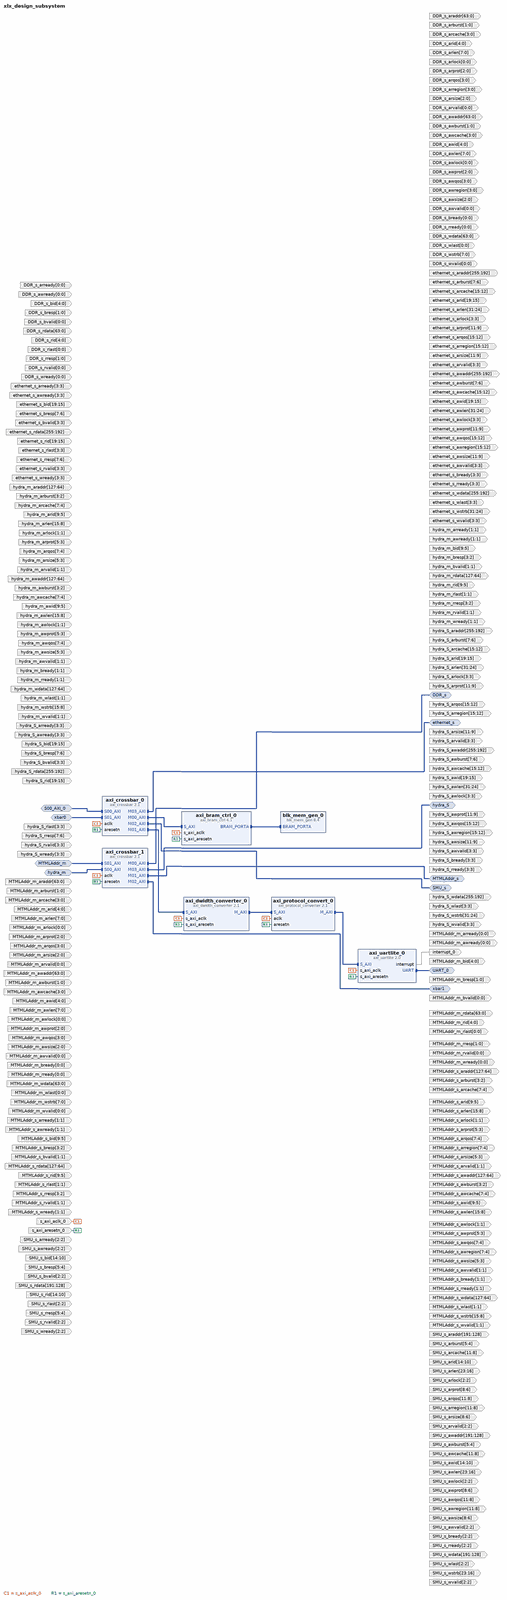
[diagram p0: block diagram of the top level, whole]
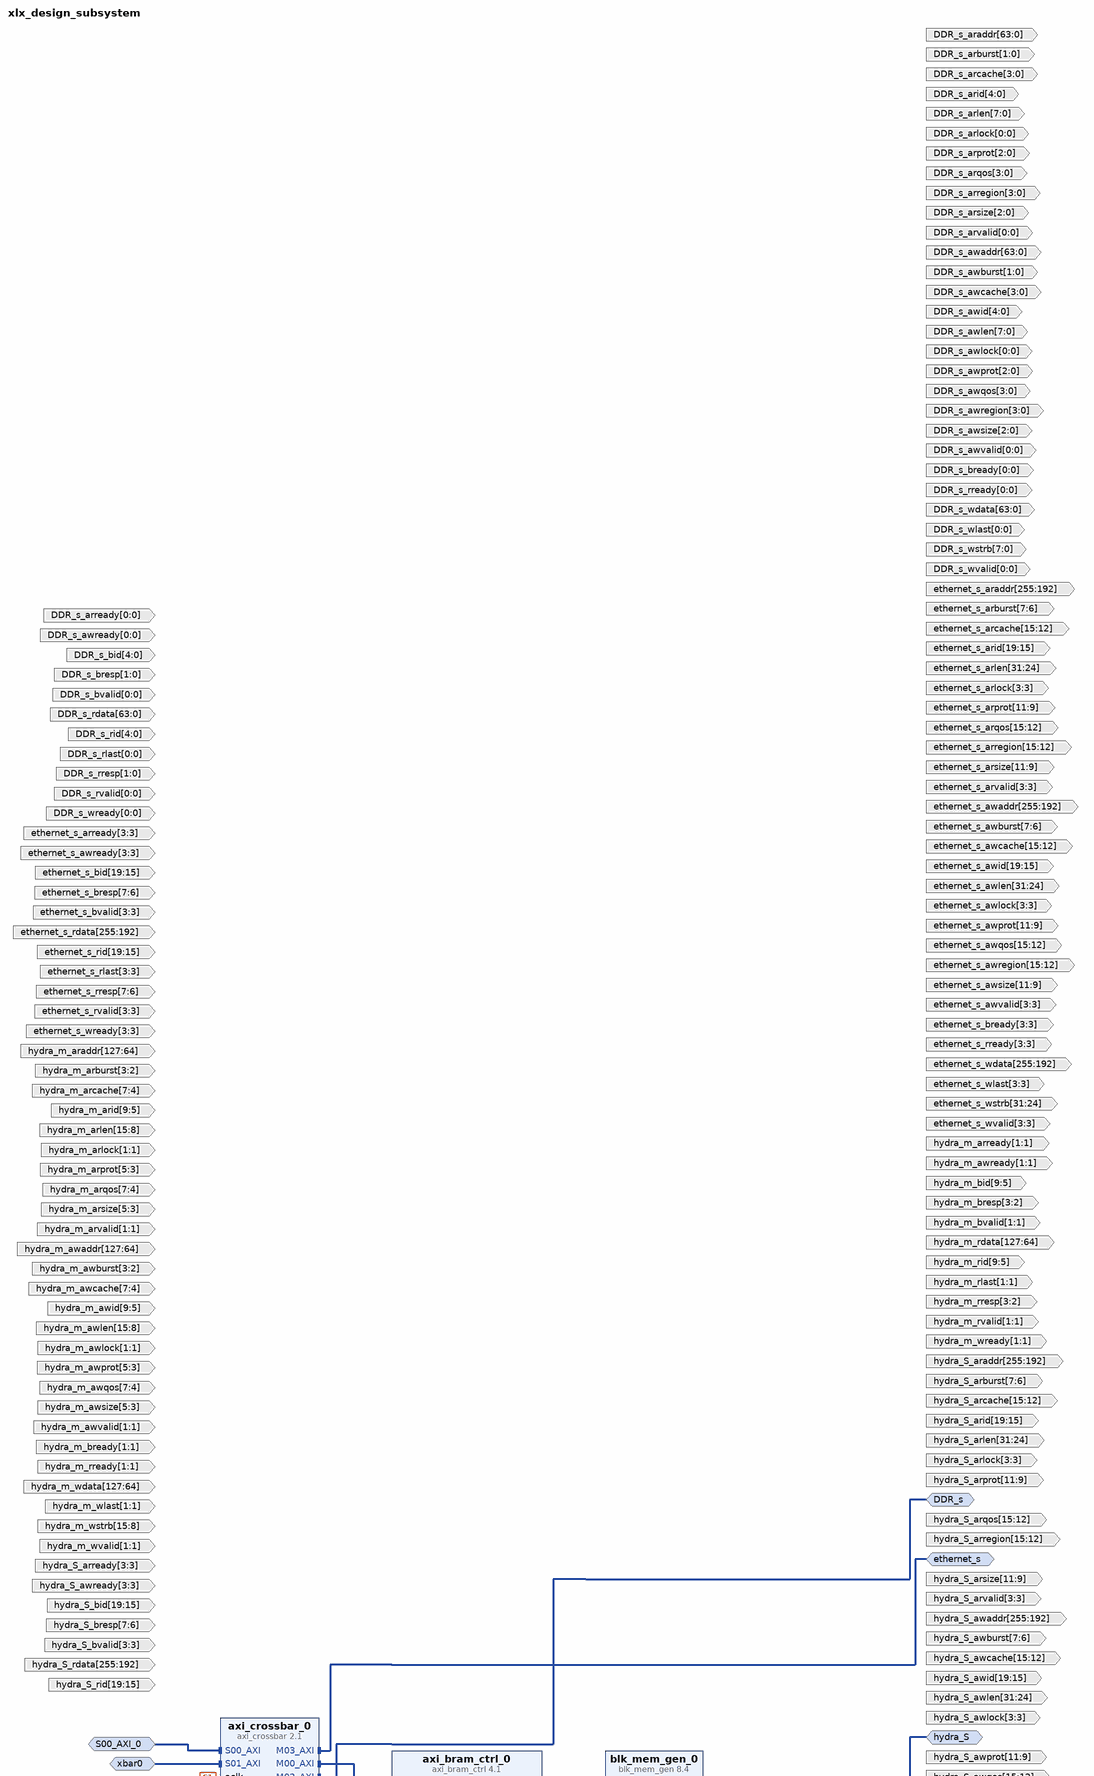
[diagram p1: block diagram of the top level, upper part]
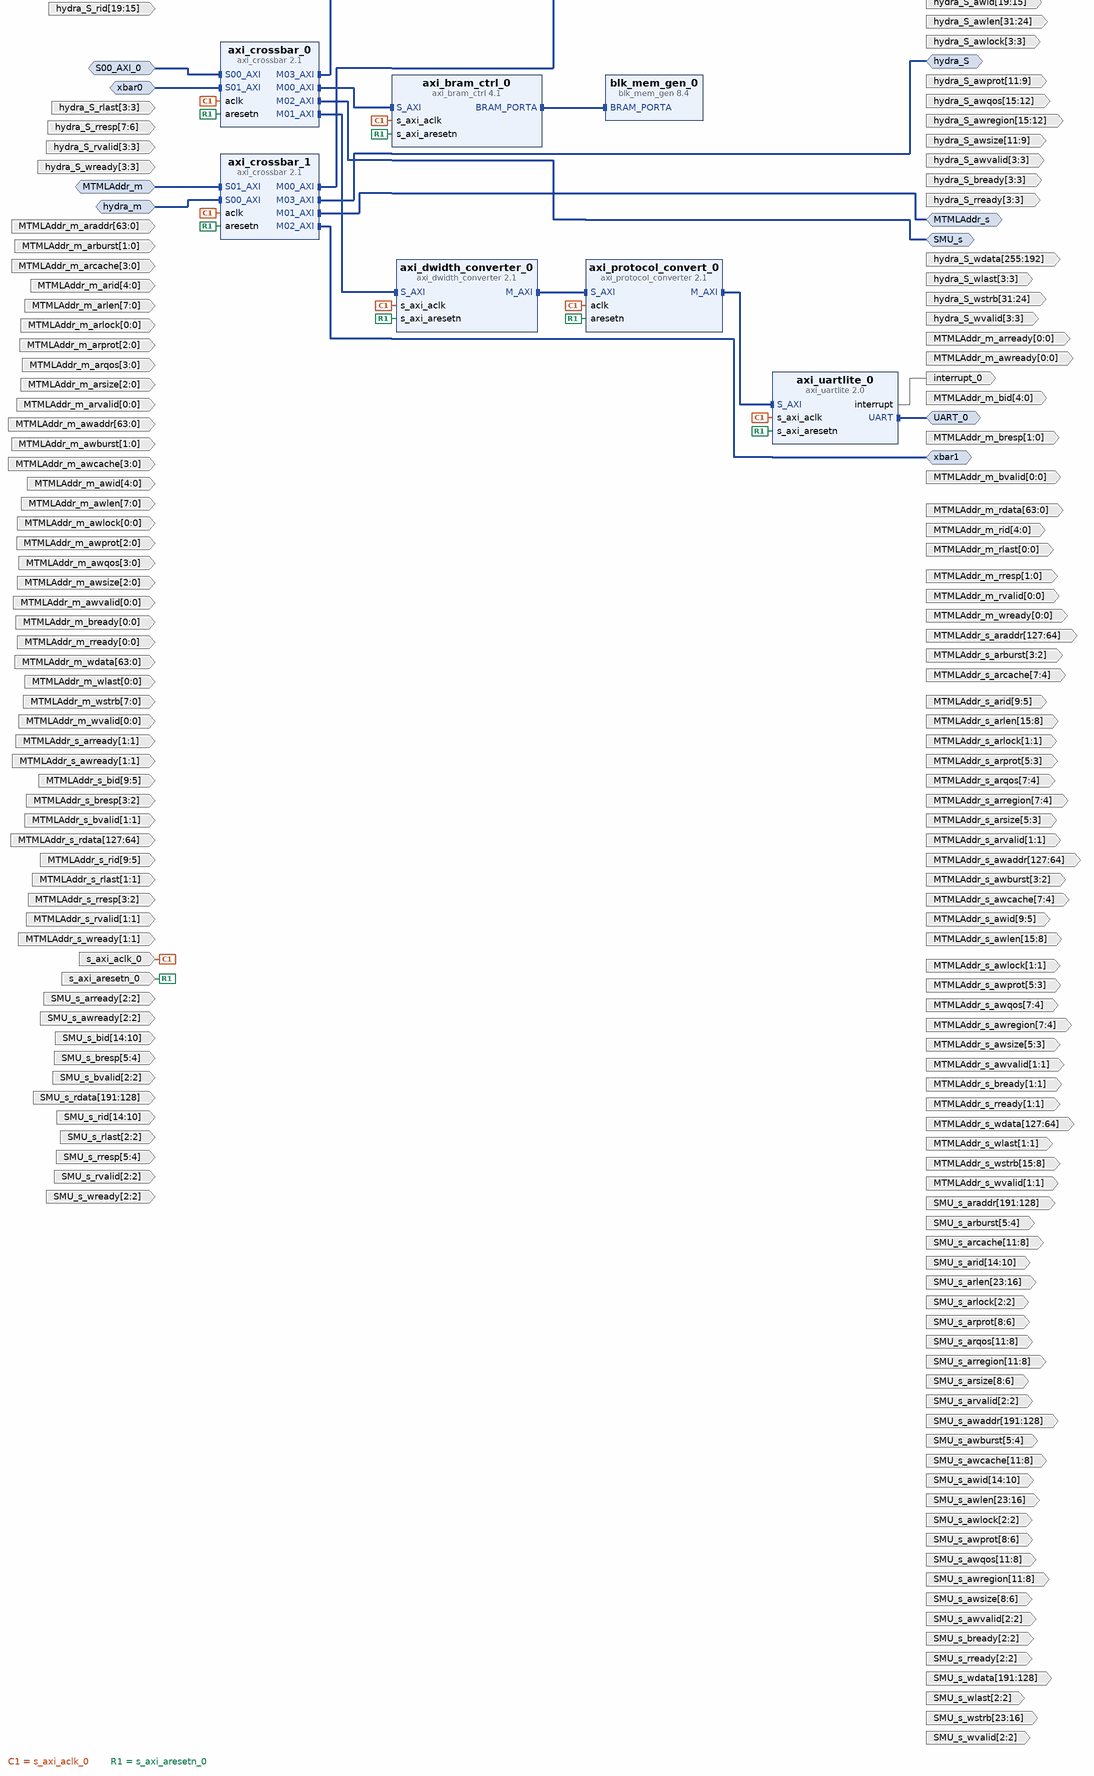
[diagram p2: block diagram of the top level, lower part]
# Vivado block design xlx_design_subsystem, xcvu9p-flga2104-1-e, Vivado 2021.1
create_bd_design xlx_design_subsystem

create_bd_intf_port -mode Slave -vlnv xilinx.com:interface:aximm_rtl:1.0 hydra_m
set_property -dict [list \
  CONFIG.ADDR_WIDTH 64 \
  CONFIG.ARUSER_WIDTH 0 \
  CONFIG.AWUSER_WIDTH 0 \
  CONFIG.BUSER_WIDTH 0 \
  CONFIG.DATA_WIDTH 64 \
  CONFIG.FREQ_HZ 10000000 \
  CONFIG.HAS_BRESP 1 \
  CONFIG.HAS_BURST 1 \
  CONFIG.HAS_CACHE 1 \
  CONFIG.HAS_LOCK 1 \
  CONFIG.HAS_PROT 1 \
  CONFIG.HAS_QOS 1 \
  CONFIG.HAS_REGION 0 \
  CONFIG.HAS_RRESP 1 \
  CONFIG.HAS_WSTRB 1 \
  CONFIG.ID_WIDTH 5 \
  CONFIG.MAX_BURST_LENGTH 256 \
  CONFIG.NUM_READ_OUTSTANDING 2 \
  CONFIG.NUM_READ_THREADS 1 \
  CONFIG.NUM_WRITE_OUTSTANDING 2 \
  CONFIG.NUM_WRITE_THREADS 1 \
  CONFIG.PROTOCOL AXI4 \
  CONFIG.READ_WRITE_MODE READ_WRITE \
  CONFIG.RUSER_BITS_PER_BYTE 0 \
  CONFIG.RUSER_WIDTH 0 \
  CONFIG.SUPPORTS_NARROW_BURST 1 \
  CONFIG.WUSER_BITS_PER_BYTE 0 \
  CONFIG.WUSER_WIDTH 0 \
] [get_bd_intf_ports hydra_m]
create_bd_intf_port -mode Master -vlnv xilinx.com:interface:aximm_rtl:1.0 SMU_s
set_property -dict [list \
  CONFIG.ADDR_WIDTH 64 \
  CONFIG.DATA_WIDTH 64 \
  CONFIG.FREQ_HZ 10000000 \
  CONFIG.NUM_READ_OUTSTANDING 2 \
  CONFIG.NUM_WRITE_OUTSTANDING 2 \
  CONFIG.PROTOCOL AXI4 \
] [get_bd_intf_ports SMU_s]
create_bd_intf_port -mode Master -vlnv xilinx.com:interface:aximm_rtl:1.0 ethernet_s
set_property -dict [list \
  CONFIG.ADDR_WIDTH 64 \
  CONFIG.DATA_WIDTH 64 \
  CONFIG.FREQ_HZ 10000000 \
  CONFIG.NUM_READ_OUTSTANDING 2 \
  CONFIG.NUM_WRITE_OUTSTANDING 2 \
  CONFIG.PROTOCOL AXI4 \
] [get_bd_intf_ports ethernet_s]
create_bd_intf_port -mode Master -vlnv xilinx.com:interface:aximm_rtl:1.0 hydra_S
set_property -dict [list \
  CONFIG.ADDR_WIDTH 64 \
  CONFIG.DATA_WIDTH 64 \
  CONFIG.FREQ_HZ 10000000 \
  CONFIG.NUM_READ_OUTSTANDING 2 \
  CONFIG.NUM_WRITE_OUTSTANDING 2 \
  CONFIG.PROTOCOL AXI4 \
] [get_bd_intf_ports hydra_S]
create_bd_intf_port -mode Master -vlnv xilinx.com:interface:aximm_rtl:1.0 DDR_s
set_property -dict [list \
  CONFIG.ADDR_WIDTH 64 \
  CONFIG.DATA_WIDTH 64 \
  CONFIG.FREQ_HZ 10000000 \
  CONFIG.HAS_REGION 0 \
  CONFIG.NUM_READ_OUTSTANDING 2 \
  CONFIG.NUM_WRITE_OUTSTANDING 2 \
  CONFIG.PROTOCOL AXI4 \
] [get_bd_intf_ports DDR_s]
create_bd_intf_port -mode Master -vlnv xilinx.com:interface:aximm_rtl:1.0 MTMLAddr_s
set_property -dict [list \
  CONFIG.ADDR_WIDTH 64 \
  CONFIG.DATA_WIDTH 64 \
  CONFIG.FREQ_HZ 10000000 \
  CONFIG.NUM_READ_OUTSTANDING 2 \
  CONFIG.NUM_WRITE_OUTSTANDING 2 \
  CONFIG.PROTOCOL AXI4 \
] [get_bd_intf_ports MTMLAddr_s]
create_bd_intf_port -mode Slave -vlnv xilinx.com:interface:aximm_rtl:1.0 MTMLAddr_m
set_property -dict [list \
  CONFIG.ADDR_WIDTH 64 \
  CONFIG.ARUSER_WIDTH 0 \
  CONFIG.AWUSER_WIDTH 0 \
  CONFIG.BUSER_WIDTH 0 \
  CONFIG.DATA_WIDTH 64 \
  CONFIG.FREQ_HZ 10000000 \
  CONFIG.HAS_BRESP 1 \
  CONFIG.HAS_BURST 1 \
  CONFIG.HAS_CACHE 1 \
  CONFIG.HAS_LOCK 1 \
  CONFIG.HAS_PROT 1 \
  CONFIG.HAS_QOS 1 \
  CONFIG.HAS_REGION 0 \
  CONFIG.HAS_RRESP 1 \
  CONFIG.HAS_WSTRB 1 \
  CONFIG.ID_WIDTH 5 \
  CONFIG.MAX_BURST_LENGTH 256 \
  CONFIG.NUM_READ_OUTSTANDING 2 \
  CONFIG.NUM_READ_THREADS 1 \
  CONFIG.NUM_WRITE_OUTSTANDING 2 \
  CONFIG.NUM_WRITE_THREADS 1 \
  CONFIG.PROTOCOL AXI4 \
  CONFIG.READ_WRITE_MODE READ_WRITE \
  CONFIG.RUSER_BITS_PER_BYTE 0 \
  CONFIG.RUSER_WIDTH 0 \
  CONFIG.SUPPORTS_NARROW_BURST 1 \
  CONFIG.WUSER_BITS_PER_BYTE 0 \
  CONFIG.WUSER_WIDTH 0 \
] [get_bd_intf_ports MTMLAddr_m]
create_bd_intf_port -mode Master -vlnv xilinx.com:interface:uart_rtl:1.0 UART_0
create_bd_intf_port -mode Slave -vlnv xilinx.com:interface:aximm_rtl:1.0 S00_AXI_0
set_property -dict [list \
  CONFIG.ADDR_WIDTH 64 \
  CONFIG.ARUSER_WIDTH 0 \
  CONFIG.AWUSER_WIDTH 0 \
  CONFIG.BUSER_WIDTH 0 \
  CONFIG.DATA_WIDTH 64 \
  CONFIG.FREQ_HZ 10000000 \
  CONFIG.HAS_BRESP 1 \
  CONFIG.HAS_BURST 1 \
  CONFIG.HAS_CACHE 1 \
  CONFIG.HAS_LOCK 1 \
  CONFIG.HAS_PROT 1 \
  CONFIG.HAS_QOS 1 \
  CONFIG.HAS_REGION 0 \
  CONFIG.HAS_RRESP 1 \
  CONFIG.HAS_WSTRB 1 \
  CONFIG.ID_WIDTH 5 \
  CONFIG.MAX_BURST_LENGTH 256 \
  CONFIG.NUM_READ_OUTSTANDING 2 \
  CONFIG.NUM_READ_THREADS 1 \
  CONFIG.NUM_WRITE_OUTSTANDING 2 \
  CONFIG.NUM_WRITE_THREADS 1 \
  CONFIG.PROTOCOL AXI4 \
  CONFIG.READ_WRITE_MODE READ_WRITE \
  CONFIG.RUSER_BITS_PER_BYTE 0 \
  CONFIG.RUSER_WIDTH 0 \
  CONFIG.SUPPORTS_NARROW_BURST 1 \
  CONFIG.WUSER_BITS_PER_BYTE 0 \
  CONFIG.WUSER_WIDTH 0 \
] [get_bd_intf_ports S00_AXI_0]
create_bd_intf_port -mode Master -vlnv xilinx.com:interface:aximm_rtl:1.0 xbar1
set_property -dict [list \
  CONFIG.ADDR_WIDTH 64 \
  CONFIG.DATA_WIDTH 64 \
  CONFIG.FREQ_HZ 10000000 \
  CONFIG.HAS_REGION 0 \
  CONFIG.NUM_READ_OUTSTANDING 2 \
  CONFIG.NUM_WRITE_OUTSTANDING 2 \
  CONFIG.PROTOCOL AXI4 \
] [get_bd_intf_ports xbar1]
create_bd_intf_port -mode Slave -vlnv xilinx.com:interface:aximm_rtl:1.0 xbar0
set_property -dict [list \
  CONFIG.ADDR_WIDTH 64 \
  CONFIG.ARUSER_WIDTH 0 \
  CONFIG.AWUSER_WIDTH 0 \
  CONFIG.BUSER_WIDTH 0 \
  CONFIG.DATA_WIDTH 64 \
  CONFIG.FREQ_HZ 10000000 \
  CONFIG.HAS_BRESP 1 \
  CONFIG.HAS_BURST 1 \
  CONFIG.HAS_CACHE 1 \
  CONFIG.HAS_LOCK 1 \
  CONFIG.HAS_PROT 1 \
  CONFIG.HAS_QOS 1 \
  CONFIG.HAS_REGION 0 \
  CONFIG.HAS_RRESP 1 \
  CONFIG.HAS_WSTRB 1 \
  CONFIG.ID_WIDTH 5 \
  CONFIG.MAX_BURST_LENGTH 256 \
  CONFIG.NUM_READ_OUTSTANDING 2 \
  CONFIG.NUM_READ_THREADS 1 \
  CONFIG.NUM_WRITE_OUTSTANDING 2 \
  CONFIG.NUM_WRITE_THREADS 1 \
  CONFIG.PROTOCOL AXI4 \
  CONFIG.READ_WRITE_MODE READ_WRITE \
  CONFIG.RUSER_BITS_PER_BYTE 0 \
  CONFIG.RUSER_WIDTH 0 \
  CONFIG.SUPPORTS_NARROW_BURST 1 \
  CONFIG.WUSER_BITS_PER_BYTE 0 \
  CONFIG.WUSER_WIDTH 0 \
] [get_bd_intf_ports xbar0]
create_bd_port -dir I -type clk s_axi_aclk_0
set_property -dict [list \
  CONFIG.ASSOCIATED_BUSIF hydra_m:SMU_s:ethernet_s:hydra_S:DDR_s:MTMLAddr_s:MTMLAddr_m:S00_AXI_0:xbar1:xbar0 \
  CONFIG.FREQ_HZ 10000000 \
] [get_bd_ports s_axi_aclk_0]
create_bd_port -dir I -type rst s_axi_aresetn_0
create_bd_port -dir I -from 9 -to 5 hydra_m_awid
create_bd_port -dir I -from 127 -to 64 hydra_m_awaddr
create_bd_port -dir I -from 15 -to 8 hydra_m_awlen
create_bd_port -dir I -from 5 -to 3 hydra_m_awsize
create_bd_port -dir I -from 3 -to 2 hydra_m_awburst
create_bd_port -dir I -from 1 -to 1 hydra_m_awlock
create_bd_port -dir I -from 7 -to 4 hydra_m_awcache
create_bd_port -dir I -from 5 -to 3 hydra_m_awprot
create_bd_port -dir I -from 7 -to 4 hydra_m_awqos
create_bd_port -dir I -from 1 -to 1 hydra_m_awvalid
create_bd_port -dir O -from 1 -to 1 hydra_m_awready
create_bd_port -dir I -from 127 -to 64 hydra_m_wdata
create_bd_port -dir I -from 15 -to 8 hydra_m_wstrb
create_bd_port -dir I -from 1 -to 1 hydra_m_wlast
create_bd_port -dir I -from 1 -to 1 hydra_m_wvalid
create_bd_port -dir O -from 1 -to 1 hydra_m_wready
create_bd_port -dir O -from 9 -to 5 hydra_m_bid
create_bd_port -dir O -from 3 -to 2 hydra_m_bresp
create_bd_port -dir O -from 1 -to 1 hydra_m_bvalid
create_bd_port -dir I -from 1 -to 1 hydra_m_bready
create_bd_port -dir I -from 9 -to 5 hydra_m_arid
create_bd_port -dir I -from 127 -to 64 hydra_m_araddr
create_bd_port -dir I -from 15 -to 8 hydra_m_arlen
create_bd_port -dir I -from 5 -to 3 hydra_m_arsize
create_bd_port -dir I -from 3 -to 2 hydra_m_arburst
create_bd_port -dir I -from 1 -to 1 hydra_m_arlock
create_bd_port -dir I -from 7 -to 4 hydra_m_arcache
create_bd_port -dir I -from 5 -to 3 hydra_m_arprot
create_bd_port -dir I -from 7 -to 4 hydra_m_arqos
create_bd_port -dir I -from 1 -to 1 hydra_m_arvalid
create_bd_port -dir O -from 1 -to 1 hydra_m_arready
create_bd_port -dir O -from 9 -to 5 hydra_m_rid
create_bd_port -dir O -from 127 -to 64 hydra_m_rdata
create_bd_port -dir O -from 3 -to 2 hydra_m_rresp
create_bd_port -dir O -from 1 -to 1 hydra_m_rlast
create_bd_port -dir O -from 1 -to 1 hydra_m_rvalid
create_bd_port -dir I -from 1 -to 1 hydra_m_rready
create_bd_port -dir O -from 14 -to 10 SMU_s_awid
create_bd_port -dir O -from 191 -to 128 SMU_s_awaddr
create_bd_port -dir O -from 23 -to 16 SMU_s_awlen
create_bd_port -dir O -from 8 -to 6 SMU_s_awsize
create_bd_port -dir O -from 5 -to 4 SMU_s_awburst
create_bd_port -dir O -from 2 -to 2 SMU_s_awlock
create_bd_port -dir O -from 11 -to 8 SMU_s_awcache
create_bd_port -dir O -from 8 -to 6 SMU_s_awprot
create_bd_port -dir O -from 11 -to 8 SMU_s_awregion
create_bd_port -dir O -from 11 -to 8 SMU_s_awqos
create_bd_port -dir O -from 2 -to 2 SMU_s_awvalid
create_bd_port -dir I -from 2 -to 2 SMU_s_awready
create_bd_port -dir O -from 191 -to 128 SMU_s_wdata
create_bd_port -dir O -from 23 -to 16 SMU_s_wstrb
create_bd_port -dir O -from 2 -to 2 SMU_s_wlast
create_bd_port -dir O -from 2 -to 2 SMU_s_wvalid
create_bd_port -dir I -from 2 -to 2 SMU_s_wready
create_bd_port -dir I -from 14 -to 10 SMU_s_bid
create_bd_port -dir I -from 5 -to 4 SMU_s_bresp
create_bd_port -dir I -from 2 -to 2 SMU_s_bvalid
create_bd_port -dir O -from 2 -to 2 SMU_s_bready
create_bd_port -dir O -from 14 -to 10 SMU_s_arid
create_bd_port -dir O -from 191 -to 128 SMU_s_araddr
create_bd_port -dir O -from 23 -to 16 SMU_s_arlen
create_bd_port -dir O -from 8 -to 6 SMU_s_arsize
create_bd_port -dir O -from 5 -to 4 SMU_s_arburst
create_bd_port -dir O -from 2 -to 2 SMU_s_arlock
create_bd_port -dir O -from 11 -to 8 SMU_s_arcache
create_bd_port -dir O -from 8 -to 6 SMU_s_arprot
create_bd_port -dir O -from 11 -to 8 SMU_s_arregion
create_bd_port -dir O -from 11 -to 8 SMU_s_arqos
create_bd_port -dir O -from 2 -to 2 SMU_s_arvalid
create_bd_port -dir I -from 2 -to 2 SMU_s_arready
create_bd_port -dir I -from 14 -to 10 SMU_s_rid
create_bd_port -dir I -from 191 -to 128 SMU_s_rdata
create_bd_port -dir I -from 5 -to 4 SMU_s_rresp
create_bd_port -dir I -from 2 -to 2 SMU_s_rlast
create_bd_port -dir I -from 2 -to 2 SMU_s_rvalid
create_bd_port -dir O -from 2 -to 2 SMU_s_rready
create_bd_port -dir O -from 19 -to 15 ethernet_s_awid
create_bd_port -dir O -from 255 -to 192 ethernet_s_awaddr
create_bd_port -dir O -from 31 -to 24 ethernet_s_awlen
create_bd_port -dir O -from 11 -to 9 ethernet_s_awsize
create_bd_port -dir O -from 7 -to 6 ethernet_s_awburst
create_bd_port -dir O -from 3 -to 3 ethernet_s_awlock
create_bd_port -dir O -from 15 -to 12 ethernet_s_awcache
create_bd_port -dir O -from 11 -to 9 ethernet_s_awprot
create_bd_port -dir O -from 15 -to 12 ethernet_s_awregion
create_bd_port -dir O -from 15 -to 12 ethernet_s_awqos
create_bd_port -dir O -from 3 -to 3 ethernet_s_awvalid
create_bd_port -dir I -from 3 -to 3 ethernet_s_awready
create_bd_port -dir O -from 255 -to 192 ethernet_s_wdata
create_bd_port -dir O -from 31 -to 24 ethernet_s_wstrb
create_bd_port -dir O -from 3 -to 3 ethernet_s_wlast
create_bd_port -dir O -from 3 -to 3 ethernet_s_wvalid
create_bd_port -dir I -from 3 -to 3 ethernet_s_wready
create_bd_port -dir I -from 19 -to 15 ethernet_s_bid
create_bd_port -dir I -from 7 -to 6 ethernet_s_bresp
create_bd_port -dir I -from 3 -to 3 ethernet_s_bvalid
create_bd_port -dir O -from 3 -to 3 ethernet_s_bready
create_bd_port -dir O -from 19 -to 15 ethernet_s_arid
create_bd_port -dir O -from 255 -to 192 ethernet_s_araddr
create_bd_port -dir O -from 31 -to 24 ethernet_s_arlen
create_bd_port -dir O -from 11 -to 9 ethernet_s_arsize
create_bd_port -dir O -from 7 -to 6 ethernet_s_arburst
create_bd_port -dir O -from 3 -to 3 ethernet_s_arlock
create_bd_port -dir O -from 15 -to 12 ethernet_s_arcache
create_bd_port -dir O -from 11 -to 9 ethernet_s_arprot
create_bd_port -dir O -from 15 -to 12 ethernet_s_arregion
create_bd_port -dir O -from 15 -to 12 ethernet_s_arqos
create_bd_port -dir O -from 3 -to 3 ethernet_s_arvalid
create_bd_port -dir I -from 3 -to 3 ethernet_s_arready
create_bd_port -dir I -from 19 -to 15 ethernet_s_rid
create_bd_port -dir I -from 255 -to 192 ethernet_s_rdata
create_bd_port -dir I -from 7 -to 6 ethernet_s_rresp
create_bd_port -dir I -from 3 -to 3 ethernet_s_rlast
create_bd_port -dir I -from 3 -to 3 ethernet_s_rvalid
create_bd_port -dir O -from 3 -to 3 ethernet_s_rready
create_bd_port -dir O -from 19 -to 15 hydra_S_awid
create_bd_port -dir O -from 255 -to 192 hydra_S_awaddr
create_bd_port -dir O -from 31 -to 24 hydra_S_awlen
create_bd_port -dir O -from 11 -to 9 hydra_S_awsize
create_bd_port -dir O -from 7 -to 6 hydra_S_awburst
create_bd_port -dir O -from 3 -to 3 hydra_S_awlock
create_bd_port -dir O -from 15 -to 12 hydra_S_awcache
create_bd_port -dir O -from 11 -to 9 hydra_S_awprot
create_bd_port -dir O -from 15 -to 12 hydra_S_awregion
create_bd_port -dir O -from 15 -to 12 hydra_S_awqos
create_bd_port -dir O -from 3 -to 3 hydra_S_awvalid
create_bd_port -dir I -from 3 -to 3 hydra_S_awready
create_bd_port -dir O -from 255 -to 192 hydra_S_wdata
create_bd_port -dir O -from 31 -to 24 hydra_S_wstrb
create_bd_port -dir O -from 3 -to 3 hydra_S_wlast
create_bd_port -dir O -from 3 -to 3 hydra_S_wvalid
create_bd_port -dir I -from 3 -to 3 hydra_S_wready
create_bd_port -dir I -from 19 -to 15 hydra_S_bid
create_bd_port -dir I -from 7 -to 6 hydra_S_bresp
create_bd_port -dir I -from 3 -to 3 hydra_S_bvalid
create_bd_port -dir O -from 3 -to 3 hydra_S_bready
create_bd_port -dir O -from 19 -to 15 hydra_S_arid
create_bd_port -dir O -from 255 -to 192 hydra_S_araddr
create_bd_port -dir O -from 31 -to 24 hydra_S_arlen
create_bd_port -dir O -from 11 -to 9 hydra_S_arsize
create_bd_port -dir O -from 7 -to 6 hydra_S_arburst
create_bd_port -dir O -from 3 -to 3 hydra_S_arlock
create_bd_port -dir O -from 15 -to 12 hydra_S_arcache
create_bd_port -dir O -from 11 -to 9 hydra_S_arprot
create_bd_port -dir O -from 15 -to 12 hydra_S_arregion
create_bd_port -dir O -from 15 -to 12 hydra_S_arqos
create_bd_port -dir O -from 3 -to 3 hydra_S_arvalid
create_bd_port -dir I -from 3 -to 3 hydra_S_arready
create_bd_port -dir I -from 19 -to 15 hydra_S_rid
create_bd_port -dir I -from 255 -to 192 hydra_S_rdata
create_bd_port -dir I -from 7 -to 6 hydra_S_rresp
create_bd_port -dir I -from 3 -to 3 hydra_S_rlast
create_bd_port -dir I -from 3 -to 3 hydra_S_rvalid
create_bd_port -dir O -from 3 -to 3 hydra_S_rready
create_bd_port -dir O -from 4 -to 0 DDR_s_awid
create_bd_port -dir O -from 63 -to 0 DDR_s_awaddr
create_bd_port -dir O -from 7 -to 0 DDR_s_awlen
create_bd_port -dir O -from 2 -to 0 DDR_s_awsize
create_bd_port -dir O -from 1 -to 0 DDR_s_awburst
create_bd_port -dir O -from 0 -to 0 DDR_s_awlock
create_bd_port -dir O -from 3 -to 0 DDR_s_awcache
create_bd_port -dir O -from 2 -to 0 DDR_s_awprot
create_bd_port -dir O -from 3 -to 0 DDR_s_awregion
create_bd_port -dir O -from 3 -to 0 DDR_s_awqos
create_bd_port -dir O -from 0 -to 0 DDR_s_awvalid
create_bd_port -dir I -from 0 -to 0 DDR_s_awready
create_bd_port -dir O -from 63 -to 0 DDR_s_wdata
create_bd_port -dir O -from 7 -to 0 DDR_s_wstrb
create_bd_port -dir O -from 0 -to 0 DDR_s_wlast
create_bd_port -dir O -from 0 -to 0 DDR_s_wvalid
create_bd_port -dir I -from 0 -to 0 DDR_s_wready
create_bd_port -dir I -from 4 -to 0 DDR_s_bid
create_bd_port -dir I -from 1 -to 0 DDR_s_bresp
create_bd_port -dir I -from 0 -to 0 DDR_s_bvalid
create_bd_port -dir O -from 0 -to 0 DDR_s_bready
create_bd_port -dir O -from 4 -to 0 DDR_s_arid
create_bd_port -dir O -from 63 -to 0 DDR_s_araddr
create_bd_port -dir O -from 7 -to 0 DDR_s_arlen
create_bd_port -dir O -from 2 -to 0 DDR_s_arsize
create_bd_port -dir O -from 1 -to 0 DDR_s_arburst
create_bd_port -dir O -from 0 -to 0 DDR_s_arlock
create_bd_port -dir O -from 3 -to 0 DDR_s_arcache
create_bd_port -dir O -from 2 -to 0 DDR_s_arprot
create_bd_port -dir O -from 3 -to 0 DDR_s_arregion
create_bd_port -dir O -from 3 -to 0 DDR_s_arqos
create_bd_port -dir O -from 0 -to 0 DDR_s_arvalid
create_bd_port -dir I -from 0 -to 0 DDR_s_arready
create_bd_port -dir I -from 4 -to 0 DDR_s_rid
create_bd_port -dir I -from 63 -to 0 DDR_s_rdata
create_bd_port -dir I -from 1 -to 0 DDR_s_rresp
create_bd_port -dir I -from 0 -to 0 DDR_s_rlast
create_bd_port -dir I -from 0 -to 0 DDR_s_rvalid
create_bd_port -dir O -from 0 -to 0 DDR_s_rready
create_bd_port -dir O -from 9 -to 5 MTMLAddr_s_awid
create_bd_port -dir O -from 127 -to 64 MTMLAddr_s_awaddr
create_bd_port -dir O -from 15 -to 8 MTMLAddr_s_awlen
create_bd_port -dir O -from 5 -to 3 MTMLAddr_s_awsize
create_bd_port -dir O -from 3 -to 2 MTMLAddr_s_awburst
create_bd_port -dir O -from 1 -to 1 MTMLAddr_s_awlock
create_bd_port -dir O -from 7 -to 4 MTMLAddr_s_awcache
create_bd_port -dir O -from 5 -to 3 MTMLAddr_s_awprot
create_bd_port -dir O -from 7 -to 4 MTMLAddr_s_awregion
create_bd_port -dir O -from 7 -to 4 MTMLAddr_s_awqos
create_bd_port -dir O -from 1 -to 1 MTMLAddr_s_awvalid
create_bd_port -dir I -from 1 -to 1 MTMLAddr_s_awready
create_bd_port -dir O -from 127 -to 64 MTMLAddr_s_wdata
create_bd_port -dir O -from 15 -to 8 MTMLAddr_s_wstrb
create_bd_port -dir O -from 1 -to 1 MTMLAddr_s_wlast
create_bd_port -dir O -from 1 -to 1 MTMLAddr_s_wvalid
create_bd_port -dir I -from 1 -to 1 MTMLAddr_s_wready
create_bd_port -dir I -from 9 -to 5 MTMLAddr_s_bid
create_bd_port -dir I -from 3 -to 2 MTMLAddr_s_bresp
create_bd_port -dir I -from 1 -to 1 MTMLAddr_s_bvalid
create_bd_port -dir O -from 1 -to 1 MTMLAddr_s_bready
create_bd_port -dir O -from 9 -to 5 MTMLAddr_s_arid
create_bd_port -dir O -from 127 -to 64 MTMLAddr_s_araddr
create_bd_port -dir O -from 15 -to 8 MTMLAddr_s_arlen
create_bd_port -dir O -from 5 -to 3 MTMLAddr_s_arsize
create_bd_port -dir O -from 3 -to 2 MTMLAddr_s_arburst
create_bd_port -dir O -from 1 -to 1 MTMLAddr_s_arlock
create_bd_port -dir O -from 7 -to 4 MTMLAddr_s_arcache
create_bd_port -dir O -from 5 -to 3 MTMLAddr_s_arprot
create_bd_port -dir O -from 7 -to 4 MTMLAddr_s_arregion
create_bd_port -dir O -from 7 -to 4 MTMLAddr_s_arqos
create_bd_port -dir O -from 1 -to 1 MTMLAddr_s_arvalid
create_bd_port -dir I -from 1 -to 1 MTMLAddr_s_arready
create_bd_port -dir I -from 9 -to 5 MTMLAddr_s_rid
create_bd_port -dir I -from 127 -to 64 MTMLAddr_s_rdata
create_bd_port -dir I -from 3 -to 2 MTMLAddr_s_rresp
create_bd_port -dir I -from 1 -to 1 MTMLAddr_s_rlast
create_bd_port -dir I -from 1 -to 1 MTMLAddr_s_rvalid
create_bd_port -dir O -from 1 -to 1 MTMLAddr_s_rready
create_bd_port -dir I -from 4 -to 0 MTMLAddr_m_awid
create_bd_port -dir I -from 63 -to 0 MTMLAddr_m_awaddr
create_bd_port -dir I -from 7 -to 0 MTMLAddr_m_awlen
create_bd_port -dir I -from 2 -to 0 MTMLAddr_m_awsize
create_bd_port -dir I -from 1 -to 0 MTMLAddr_m_awburst
create_bd_port -dir I -from 0 -to 0 MTMLAddr_m_awlock
create_bd_port -dir I -from 3 -to 0 MTMLAddr_m_awcache
create_bd_port -dir I -from 2 -to 0 MTMLAddr_m_awprot
create_bd_port -dir I -from 3 -to 0 MTMLAddr_m_awqos
create_bd_port -dir I -from 0 -to 0 MTMLAddr_m_awvalid
create_bd_port -dir O -from 0 -to 0 MTMLAddr_m_awready
create_bd_port -dir I -from 63 -to 0 MTMLAddr_m_wdata
create_bd_port -dir I -from 7 -to 0 MTMLAddr_m_wstrb
create_bd_port -dir I -from 0 -to 0 MTMLAddr_m_wlast
create_bd_port -dir I -from 0 -to 0 MTMLAddr_m_wvalid
create_bd_port -dir O -from 0 -to 0 MTMLAddr_m_wready
create_bd_port -dir O -from 4 -to 0 MTMLAddr_m_bid
create_bd_port -dir O -from 1 -to 0 MTMLAddr_m_bresp
create_bd_port -dir O -from 0 -to 0 MTMLAddr_m_bvalid
create_bd_port -dir I -from 0 -to 0 MTMLAddr_m_bready
create_bd_port -dir I -from 4 -to 0 MTMLAddr_m_arid
create_bd_port -dir I -from 63 -to 0 MTMLAddr_m_araddr
create_bd_port -dir I -from 7 -to 0 MTMLAddr_m_arlen
create_bd_port -dir I -from 2 -to 0 MTMLAddr_m_arsize
create_bd_port -dir I -from 1 -to 0 MTMLAddr_m_arburst
create_bd_port -dir I -from 0 -to 0 MTMLAddr_m_arlock
create_bd_port -dir I -from 3 -to 0 MTMLAddr_m_arcache
create_bd_port -dir I -from 2 -to 0 MTMLAddr_m_arprot
create_bd_port -dir I -from 3 -to 0 MTMLAddr_m_arqos
create_bd_port -dir I -from 0 -to 0 MTMLAddr_m_arvalid
create_bd_port -dir O -from 0 -to 0 MTMLAddr_m_arready
create_bd_port -dir O -from 4 -to 0 MTMLAddr_m_rid
create_bd_port -dir O -from 63 -to 0 MTMLAddr_m_rdata
create_bd_port -dir O -from 1 -to 0 MTMLAddr_m_rresp
create_bd_port -dir O -from 0 -to 0 MTMLAddr_m_rlast
create_bd_port -dir O -from 0 -to 0 MTMLAddr_m_rvalid
create_bd_port -dir I -from 0 -to 0 MTMLAddr_m_rready
create_bd_port -dir O -type intr interrupt_0

create_bd_cell -type ip -vlnv xilinx.com:ip:axi_dwidth_converter:2.1 axi_dwidth_converter_0
set_property -dict [list \
  CONFIG.ADDR_WIDTH 64 \
  CONFIG.MI_DATA_WIDTH 32 \
  CONFIG.PROTOCOL AXI4 \
  CONFIG.SI_DATA_WIDTH 64 \
  CONFIG.SI_ID_WIDTH 5 \
] [get_bd_cells axi_dwidth_converter_0]
create_bd_cell -type ip -vlnv xilinx.com:ip:axi_protocol_converter:2.1 axi_protocol_convert_0
set_property -dict [list \
  CONFIG.ADDR_WIDTH 64 \
  CONFIG.MI_PROTOCOL AXI4LITE \
  CONFIG.SI_PROTOCOL AXI4 \
  CONFIG.TRANSLATION_MODE 2 \
] [get_bd_cells axi_protocol_convert_0]
create_bd_cell -type ip -vlnv xilinx.com:ip:axi_crossbar:2.1 axi_crossbar_0
set_property -dict [list \
  CONFIG.ADDR_WIDTH 64 \
  CONFIG.DATA_WIDTH 64 \
  CONFIG.ID_WIDTH 5 \
  CONFIG.M04_S01_READ_CONNECTIVITY 0 \
  CONFIG.M04_S01_WRITE_CONNECTIVITY 0 \
  CONFIG.NUM_MI 4 \
  CONFIG.NUM_SI 2 \
  CONFIG.S01_BASE_ID 0x00000010 \
  CONFIG.S02_BASE_ID 0x00000020 \
  CONFIG.S03_BASE_ID 0x00000030 \
  CONFIG.S04_BASE_ID 0x00000040 \
  CONFIG.S05_BASE_ID 0x00000050 \
  CONFIG.S06_BASE_ID 0x00000060 \
  CONFIG.S07_BASE_ID 0x00000070 \
  CONFIG.S08_BASE_ID 0x00000080 \
  CONFIG.S09_BASE_ID 0x00000090 \
  CONFIG.S10_BASE_ID 0x000000a0 \
  CONFIG.S11_BASE_ID 0x000000b0 \
  CONFIG.S12_BASE_ID 0x000000c0 \
  CONFIG.S13_BASE_ID 0x000000d0 \
  CONFIG.S14_BASE_ID 0x000000e0 \
  CONFIG.S15_BASE_ID 0x000000f0 \
] [get_bd_cells axi_crossbar_0]
create_bd_cell -type ip -vlnv xilinx.com:ip:axi_bram_ctrl:4.1 axi_bram_ctrl_0
set_property -dict {CONFIG.DATA_WIDTH 64 CONFIG.SINGLE_PORT_BRAM 1} [get_bd_cells axi_bram_ctrl_0]
create_bd_cell -type ip -vlnv xilinx.com:ip:blk_mem_gen:8.4 blk_mem_gen_0
set_property -dict [list \
  CONFIG.EN_SAFETY_CKT true \
  CONFIG.Enable_32bit_Address true \
  CONFIG.Read_Width_A 64 \
  CONFIG.Register_PortA_Output_of_Memory_Primitives false \
  CONFIG.Use_RSTA_Pin true \
  CONFIG.Write_Width_A 64 \
  CONFIG.use_bram_block BRAM_Controller \
] [get_bd_cells blk_mem_gen_0]
create_bd_cell -type ip -vlnv xilinx.com:ip:axi_crossbar:2.1 axi_crossbar_1
set_property -dict [list \
  CONFIG.ADDR_RANGES 1 \
  CONFIG.ADDR_WIDTH 64 \
  CONFIG.DATA_WIDTH 64 \
  CONFIG.ID_WIDTH 5 \
  CONFIG.M00_A00_ADDR_WIDTH 24 \
  CONFIG.M00_A00_BASE_ADDR 0x0000000080000000 \
  CONFIG.M01_A00_ADDR_WIDTH 24 \
  CONFIG.M01_A00_BASE_ADDR 0x0000000082000000 \
  CONFIG.M02_A00_ADDR_WIDTH 24 \
  CONFIG.M02_A00_BASE_ADDR 0x0000000081000000 \
  CONFIG.M03_A00_ADDR_WIDTH 24 \
  CONFIG.M03_A00_BASE_ADDR 0x0000000083000000 \
  CONFIG.M03_S01_READ_CONNECTIVITY 1 \
  CONFIG.M03_S01_WRITE_CONNECTIVITY 1 \
  CONFIG.NUM_MI 4 \
  CONFIG.NUM_SI 2 \
  CONFIG.S01_BASE_ID 0x00000010 \
  CONFIG.S02_BASE_ID 0x00000020 \
  CONFIG.S03_BASE_ID 0x00000030 \
  CONFIG.S04_BASE_ID 0x00000040 \
  CONFIG.S05_BASE_ID 0x00000050 \
  CONFIG.S06_BASE_ID 0x00000060 \
  CONFIG.S07_BASE_ID 0x00000070 \
  CONFIG.S08_BASE_ID 0x00000080 \
  CONFIG.S09_BASE_ID 0x00000090 \
  CONFIG.S10_BASE_ID 0x000000a0 \
  CONFIG.S11_BASE_ID 0x000000b0 \
  CONFIG.S12_BASE_ID 0x000000c0 \
  CONFIG.S13_BASE_ID 0x000000d0 \
  CONFIG.S14_BASE_ID 0x000000e0 \
  CONFIG.S15_BASE_ID 0x000000f0 \
] [get_bd_cells axi_crossbar_1]
create_bd_cell -type ip -vlnv xilinx.com:ip:axi_uartlite:2.0 axi_uartlite_0

# ---- connections ----

connect_bd_intf_net [get_bd_intf_ports MTMLAddr_m] [get_bd_intf_pins axi_crossbar_1/S01_AXI]
connect_bd_intf_net -intf_net S00_AXI_0_2 [get_bd_intf_ports S00_AXI_0] [get_bd_intf_pins axi_crossbar_0/S00_AXI]
connect_bd_intf_net -intf_net S01_AXI_0_2 [get_bd_intf_ports xbar0] [get_bd_intf_pins axi_crossbar_0/S01_AXI]
connect_bd_intf_net [get_bd_intf_pins axi_bram_ctrl_0/BRAM_PORTA] [get_bd_intf_pins blk_mem_gen_0/BRAM_PORTA]
connect_bd_intf_net [get_bd_intf_pins axi_crossbar_0/M00_AXI] [get_bd_intf_pins axi_bram_ctrl_0/S_AXI]
connect_bd_intf_net [get_bd_intf_pins axi_crossbar_0/M01_AXI] [get_bd_intf_pins axi_dwidth_converter_0/S_AXI]
connect_bd_intf_net [get_bd_intf_ports SMU_s] [get_bd_intf_pins axi_crossbar_0/M02_AXI]
connect_bd_intf_net [get_bd_intf_ports ethernet_s] [get_bd_intf_pins axi_crossbar_0/M03_AXI]
connect_bd_intf_net [get_bd_intf_ports DDR_s] [get_bd_intf_pins axi_crossbar_1/M00_AXI]
connect_bd_intf_net [get_bd_intf_ports MTMLAddr_s] [get_bd_intf_pins axi_crossbar_1/M01_AXI]
connect_bd_intf_net [get_bd_intf_ports xbar1] [get_bd_intf_pins axi_crossbar_1/M02_AXI]
connect_bd_intf_net [get_bd_intf_ports hydra_S] [get_bd_intf_pins axi_crossbar_1/M03_AXI]
connect_bd_intf_net [get_bd_intf_pins axi_dwidth_converter_0/M_AXI] [get_bd_intf_pins axi_protocol_convert_0/S_AXI]
connect_bd_intf_net [get_bd_intf_pins axi_uartlite_0/S_AXI] [get_bd_intf_pins axi_protocol_convert_0/M_AXI]
connect_bd_intf_net [get_bd_intf_ports UART_0] [get_bd_intf_pins axi_uartlite_0/UART]
connect_bd_intf_net [get_bd_intf_ports hydra_m] [get_bd_intf_pins axi_crossbar_1/S00_AXI]
connect_bd_net [get_bd_pins axi_uartlite_0/interrupt] [get_bd_ports interrupt_0]
connect_bd_net -net s_axi_aclk_0_1 [get_bd_ports s_axi_aclk_0] \
  [get_bd_pins axi_protocol_convert_0/aclk] [get_bd_pins axi_crossbar_0/aclk] [get_bd_pins axi_dwidth_converter_0/s_axi_aclk] \
  [get_bd_pins axi_crossbar_1/aclk] [get_bd_pins axi_bram_ctrl_0/s_axi_aclk] [get_bd_pins axi_uartlite_0/s_axi_aclk]
connect_bd_net -net s_axi_aresetn_0_1 [get_bd_ports s_axi_aresetn_0] \
  [get_bd_pins axi_dwidth_converter_0/s_axi_aresetn] [get_bd_pins axi_protocol_convert_0/aresetn] \
  [get_bd_pins axi_crossbar_0/aresetn] [get_bd_pins axi_crossbar_1/aresetn] [get_bd_pins axi_bram_ctrl_0/s_axi_aresetn] \
  [get_bd_pins axi_uartlite_0/s_axi_aresetn]

# ---- address map ----
assign_bd_address -offset 0x0000000080000000 -range 64K -target_address_space [get_bd_addr_spaces hydra_m] [get_bd_addr_segs DDR_s/Reg]
assign_bd_address -offset 0x0000000081000000 -range 64K -target_address_space [get_bd_addr_spaces hydra_m] [get_bd_addr_segs xbar1/Reg]
assign_bd_address -offset 0x0000000083000000 -range 64K -target_address_space [get_bd_addr_spaces hydra_m] [get_bd_addr_segs MTMLAddr_s/Reg]
assign_bd_address -offset 0x0000000080000000 -range 64K -target_address_space [get_bd_addr_spaces MTMLAddr_m] [get_bd_addr_segs DDR_s/Reg]
assign_bd_address -offset 0x0000000081000000 -range 64K -target_address_space [get_bd_addr_spaces MTMLAddr_m] [get_bd_addr_segs xbar1/Reg]
assign_bd_address -offset 0x0000000082000000 -range 64K -target_address_space [get_bd_addr_spaces MTMLAddr_m] [get_bd_addr_segs hydra_S/Reg]
assign_bd_address -offset 0x0000000083000000 -range 64K -target_address_space [get_bd_addr_spaces MTMLAddr_m] [get_bd_addr_segs MTMLAddr_s/Reg]
assign_bd_address -offset 0x0000000000000000 -range 8K -target_address_space [get_bd_addr_spaces S00_AXI_0] [get_bd_addr_segs axi_bram_ctrl_0/S_AXI/Mem0]
assign_bd_address -offset 0x0000000000040000 -range 64K -target_address_space [get_bd_addr_spaces S00_AXI_0] [get_bd_addr_segs axi_uartlite_0/S_AXI/Reg]
assign_bd_address -offset 0x0000000000080000 -range 64K -target_address_space [get_bd_addr_spaces S00_AXI_0] [get_bd_addr_segs SMU_s/Reg]
assign_bd_address -offset 0x00000000000C0000 -range 64K -target_address_space [get_bd_addr_spaces S00_AXI_0] [get_bd_addr_segs ethernet_s/Reg]
assign_bd_address -offset 0x0000000000000000 -range 8K -target_address_space [get_bd_addr_spaces xbar0] [get_bd_addr_segs axi_bram_ctrl_0/S_AXI/Mem0]
assign_bd_address -offset 0x0000000000040000 -range 64K -target_address_space [get_bd_addr_spaces xbar0] [get_bd_addr_segs axi_uartlite_0/S_AXI/Reg]
assign_bd_address -offset 0x0000000000080000 -range 64K -target_address_space [get_bd_addr_spaces xbar0] [get_bd_addr_segs SMU_s/Reg]
assign_bd_address -offset 0x00000000000C0000 -range 64K -target_address_space [get_bd_addr_spaces xbar0] [get_bd_addr_segs ethernet_s/Reg]

validate_bd_design
save_bd_design
